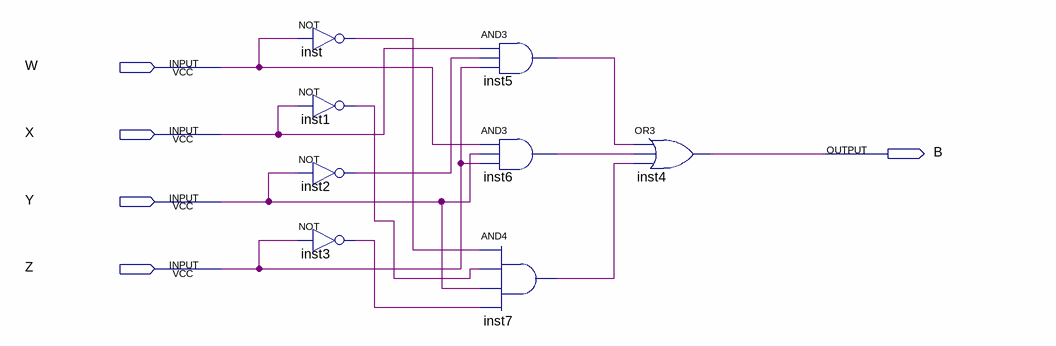
[diagram p0: schematic sheet]
// Quartus schematic uncle_bob.bdf as structural Verilog: 8 symbols, 5 pins
module uncle_bob (
  input  W,
  input  X,
  input  Y,
  input  Z,
  output B
);

  wire inst1_out, inst2_out, inst3_out, inst5_out, inst6_out, inst7_out, inst_out;

  not inst (inst_out, W);
  not inst1 (inst1_out, X);
  not inst2 (inst2_out, Y);
  not inst3 (inst3_out, Z);
  and inst5 (inst5_out, X, inst2_out, Z);
  and inst6 (inst6_out, W, Y, Z);
  and inst7 (inst7_out, inst_out, inst1_out, Y, inst3_out);
  or inst4 (B, inst5_out, inst6_out, inst7_out);
endmodule
